# Altium schematic sheet ET-DAC.SchDoc
size A4
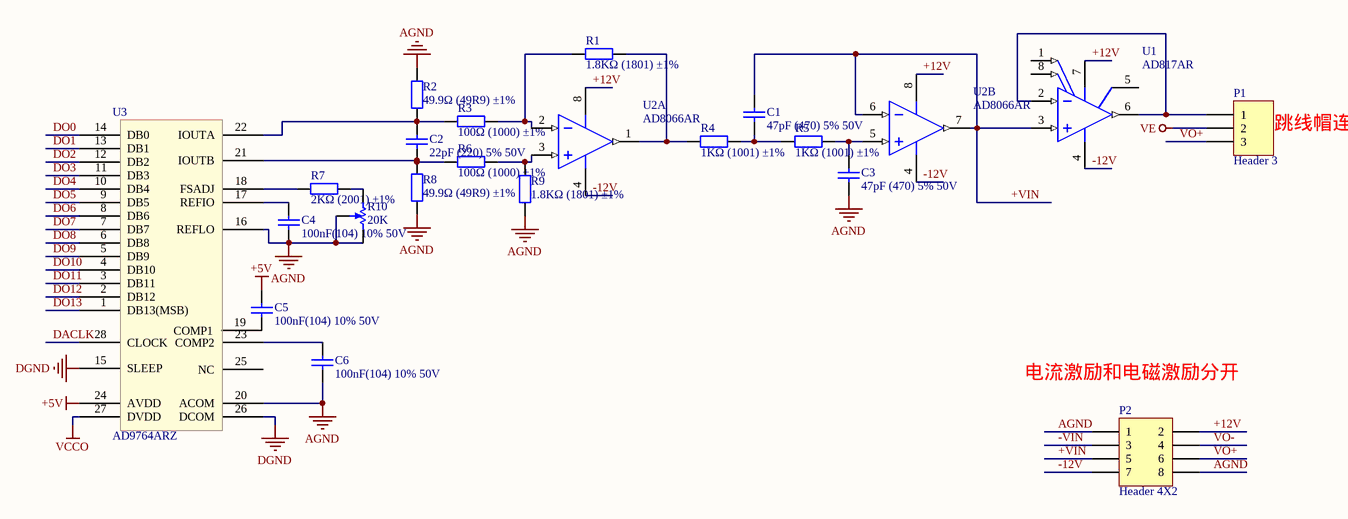
[diagram p0: ET-DAC.SchDoc]

## Parts
C1  47pF (470) 5% 50V  [LC-0805_C]
C2  22pF (220) 5% 50V  [LC-0805_C]
C3  47pF (470) 5% 50V  [LC-0805_C]
C4  100nF(104) 10% 50V  [LC-0805_C]
C5  100nF(104) 10% 50V  [LC-0805_C]
C6  100nF(104) 10% 50V  [LC-0805_C]
P1  Header 3  [HDR1X3]
P2  Header 4X2  [HDR2X4]
R1  1.8KΩ (1801) ±1%  [LC-0805_R]
R2  49.9Ω (49R9) ±1%  [LC-0805_R]
R3  100Ω (1000) ±1%  [LC-0805_R]
R4  1KΩ (1001) ±1%  [LC-0805_R]
R5  1KΩ (1001) ±1%  [LC-0805_R]
R6  100Ω (1000) ±1%  [LC-0805_R]
R7  2KΩ (2001) ±1%  [LC-0805_R]
R8  49.9Ω (49R9) ±1%  [LC-0805_R]
R9  1.8KΩ (1801) ±1%  [LC-0805_R]
R10  20K  [POT4MM-2]
U1  AD817AR  [ADI-R-8_N]
U2  AD8066AR  [ADI-R-8_N]  (parts A,B of 2)
U3  AD9764ARZ  [RW_28]

## Nets
+5V: C5.2 U3.24(AVDD)
AGND: C3.2 C4.1 C6.1 P2.1 P2.8 R2.2 R8.1 R9.1 R10.CW(+) R10.W U3.16(REFLO) U3.20(ACOM)
DGND: U3.15(SLEEP) U3.26(DCOM)
VCCO: U3.27(DVDD)
VE: P1.2
+12V: P2.2 U1.7(+VS) U2.8(+VS)
+VIN: C1.2 P2.5 U1.3(+IN) U2.6(-IN_2) U2.7(VOUT_2)
-12V: P2.7 U1.4(-VS) U2.4(-VS)
-VIN: P2.3
DACLK: U3.28(CLOCK)
DO0: U3.14(DB0)
DO1: U3.13(DB1)
DO2: U3.12(DB2)
DO3: U3.11(DB3)
DO4: U3.10(DB4)
DO5: U3.9(DB5)
DO6: U3.8(DB6)
DO7: U3.7(DB7)
DO8: U3.6(DB8)
DO9: U3.5(DB9)
DO10: U3.4(DB10)
DO11: U3.3(DB11)
DO12: U3.2(DB12)
DO13: U3.1(DB13(MSB))
VO+: P1.3 P2.6
VO-: P2.4
NetC1_1: C1.1 R4.2 R5.2
NetC2_1: C2.1 R6.1 R8.2 U3.21(IOUTB)
NetC2_2: C2.2 R2.1 R3.1 U3.22(IOUTA)
NetC3_1: C3.1 R5.1 U2.5(+IN_2)
NetC4_2: C4.2 U3.17(REFIO)
NetC5_1: C5.1 U3.19(COMP1)
NetC6_2: C6.2 U3.23(COMP2)
NetP1_1: P1.1 U1.2(-IN) U1.6(OUT)
NetR1_1: R1.1 R3.2 U2.2(-IN_1)
NetR1_2: R1.2 R4.1 U2.1(VOUT_1)
NetR6_2: R6.2 R9.2 U2.3(+IN_1)
NetR7_1: R7.1 U3.18(FSADJ)
NetR7_2: R7.2 R10.CCW(-)

Not connected (* = marked no-connect by the designer): U1 1(NULL) 5(NC) 8(NULL); U3 25(NC)

## Notes on the sheet
- (near P1) 跳线帽连接
- (near P2) 电流激励和电磁激励分开

## Library data of the parts
C1 C3 = 0805 47pF (470) 5% 50V: 贴片电容; ComponentLink1Description: 供应商链接; ComponentLink1URL: http://www.szlcsc.com/product/details_15529.html; Package: 0805; Supplier: LC; SuppliersPartNumber: C14857
C2 = 0805 22pF (220) 5% 50V: 贴片电容; ComponentLink1Description: 供应商链接; ComponentLink1URL: http://www.szlcsc.com/product/details_2156.html; Package: 0805; Supplier: LC; SuppliersPartNumber: C1804
C4-C6 = 0805 100nF(104) 10% 50V: 贴片电容; ComponentLink1Description: 供应商链接; ComponentLink1URL: http://www.szlcsc.com/product/details_50686.html; Package: 0805; Supplier: LC; SuppliersPartNumber: C49678
P1 = Header 3: Header, 3-Pin; LatestRevisionDate: 17-Jul-2002; LatestRevisionNote: Re-released for DXP Platform.; Publisher: Altium Limited
P2 = Header 4X2: Header, 4-Pin, Dual row; LatestRevisionDate: 17-Jul-2002; LatestRevisionNote: Re-released for DXP Platform.; Publisher: Altium Limited
R1 R9 = 0805 1.8KΩ (1801) 1%: 贴片电阻; ComponentLink1Description: 供应商链接; ComponentLink1URL: http://www.szlcsc.com/product/details_18086.html; Package: 0805; Supplier: LC; SuppliersPartNumber: C17398
R2 R8 = 0805 49.9Ω (49R9) 1%: 贴片电阻; ComponentLink1Description: 供应商链接; ComponentLink1URL: http://www.szlcsc.com/product/details_18408.html; Package: 0805; Supplier: LC; SuppliersPartNumber: C17720
R3 R6 = 0805 100Ω (1000) 1%: 贴片电阻; ComponentLink1Description: 供应商链接; ComponentLink1URL: http://www.szlcsc.com/product/details_18096.html; Package: 0805; Supplier: LC; SuppliersPartNumber: C17408
R4 R5 = 0805 1KΩ (1001) 1%: 贴片电阻; ComponentLink1Description: 供应商链接; ComponentLink1URL: http://www.szlcsc.com/product/details_18201.html; Package: 0805; Supplier: LC; SuppliersPartNumber: C17513
R7 = 0805 2KΩ (2001) 1%: 贴片电阻; ComponentLink1Description: 供应商链接; ComponentLink1URL: http://www.szlcsc.com/product/details_18292.html; Package: 0805; Supplier: LC; SuppliersPartNumber: C17604
R10 = RPot SM: Square Trimming Potentiometer; Published: 17-Dec-2003; DatasheetVersion: Oct-2003; PackageReference: POT4MM-2; Publisher: Altium Limited; PackageDescription: Square Trimming Potentiometer; ComponentLink1Description: Manufacturer Link; ComponentLink1URL: http://bourns.com/2/search.html
U1 = AD817AR: Single Channel Low Power Operational Amplifier, 50 MHz BW, 350 V/us SR, Industrial, 8-pin SOIC (R-8), Tube; Generic Part Number: AD817; Manufacturer: Analog Devices; Amplifiers Per Package: 1; Input Bias Current: 3.3uA; Input Offset Voltage: 500uV; Iq/Amp: 7.5mA; Small Signal Bandwidth: 50MHz; V Span Max: 36V; V Span Min: 5V; DatasheetVersion: Rev. B; PackageVersion: 060506-A; PackageReference: R-8; PackageDescription: 8-Pin Standard Small Outline Package, Body 3.9 x 4.9 mm, Pitch 1.27 mm; Supplier 1: Digi-Key; Supplier Part Number 1: AD817AR-ND; Slew Rate: 350V/us; Mounting Technology: Surface Mount; Code_JEDEC: MS-012-AA; PartNumber: AD817AR; ComponentLink1Description: Manufacturer URL; ComponentLink1URL: http://www.analog.com/en/index.html; ComponentLink2Description: Datasheet; ComponentLink2URL: http://www.analog.com/static/imported-files/data_sheets/AD817.pdf; ComponentLink3Description: Package Specification; ComponentLink3URL: http://www.analog.com/static/imported-files/packages/PKG_PDF/SOIC_Narrow%20(R)/R_8.pdf
U2 = AD8066AR: Double Channel Low Power Operational Amplifier, 145 MHz BW, 180 V/us SR, Industrial, 8-pin SOIC (R-8), Tube; Generic Part Number: AD8066; Manufacturer: Analog Devices; Amplifiers Per Package: 2; Input Bias Current: 2pA; Input Offset Voltage: 400uV; Iq/Amp: 7.4mA; Small Signal Bandwidth: 145MHz; V Span Max: 24V; V Span Min: 5V; DatasheetVersion: Rev. J; PackageVersion: 060506-A; PackageReference: R-8; PackageDescription: 8-Pin Standard Small Outline Package, Body 3.9 x 4.9 mm, Pitch 1.27 mm; Supplier 1: Digi-Key; Supplier Part Number 1: AD8066AR-ND; Slew Rate: 180V/us; Mounting Technology: Surface Mount; Code_JEDEC: MS-012-AA; PartNumber: AD8066AR; ComponentLink1Description: Manufacturer URL; ComponentLink1URL: http://www.analog.com/en/index.html; ComponentLink2Description: Datasheet; ComponentLink2URL: http://www.analog.com/static/imported-files/data_sheets/AD8065_8066.pdf; ComponentLink3Description: Package Specification; ComponentLink3URL: http://www.analog.com/static/imported-files/packages/PKG_PDF/SOIC_Narrow%20(R)/R_8.pdf; ComponentLink4Description: Reference Circuit; ComponentLink4URL: http://www.analog.com/en/all-operational-amplifiers-op-amps/operational-amplifiers-op-amps/ad8066/products/product.html#product-recommendations
U3 = AD9764ARZ: Imported; Manufacturer_Part_Number: AD9764ARZ; Vendor: Vendor; Value: Value; Type: Type; RefDes: Refdes